# Altium schematic sheet LEDMicro.SchDOc
size OrCAD E
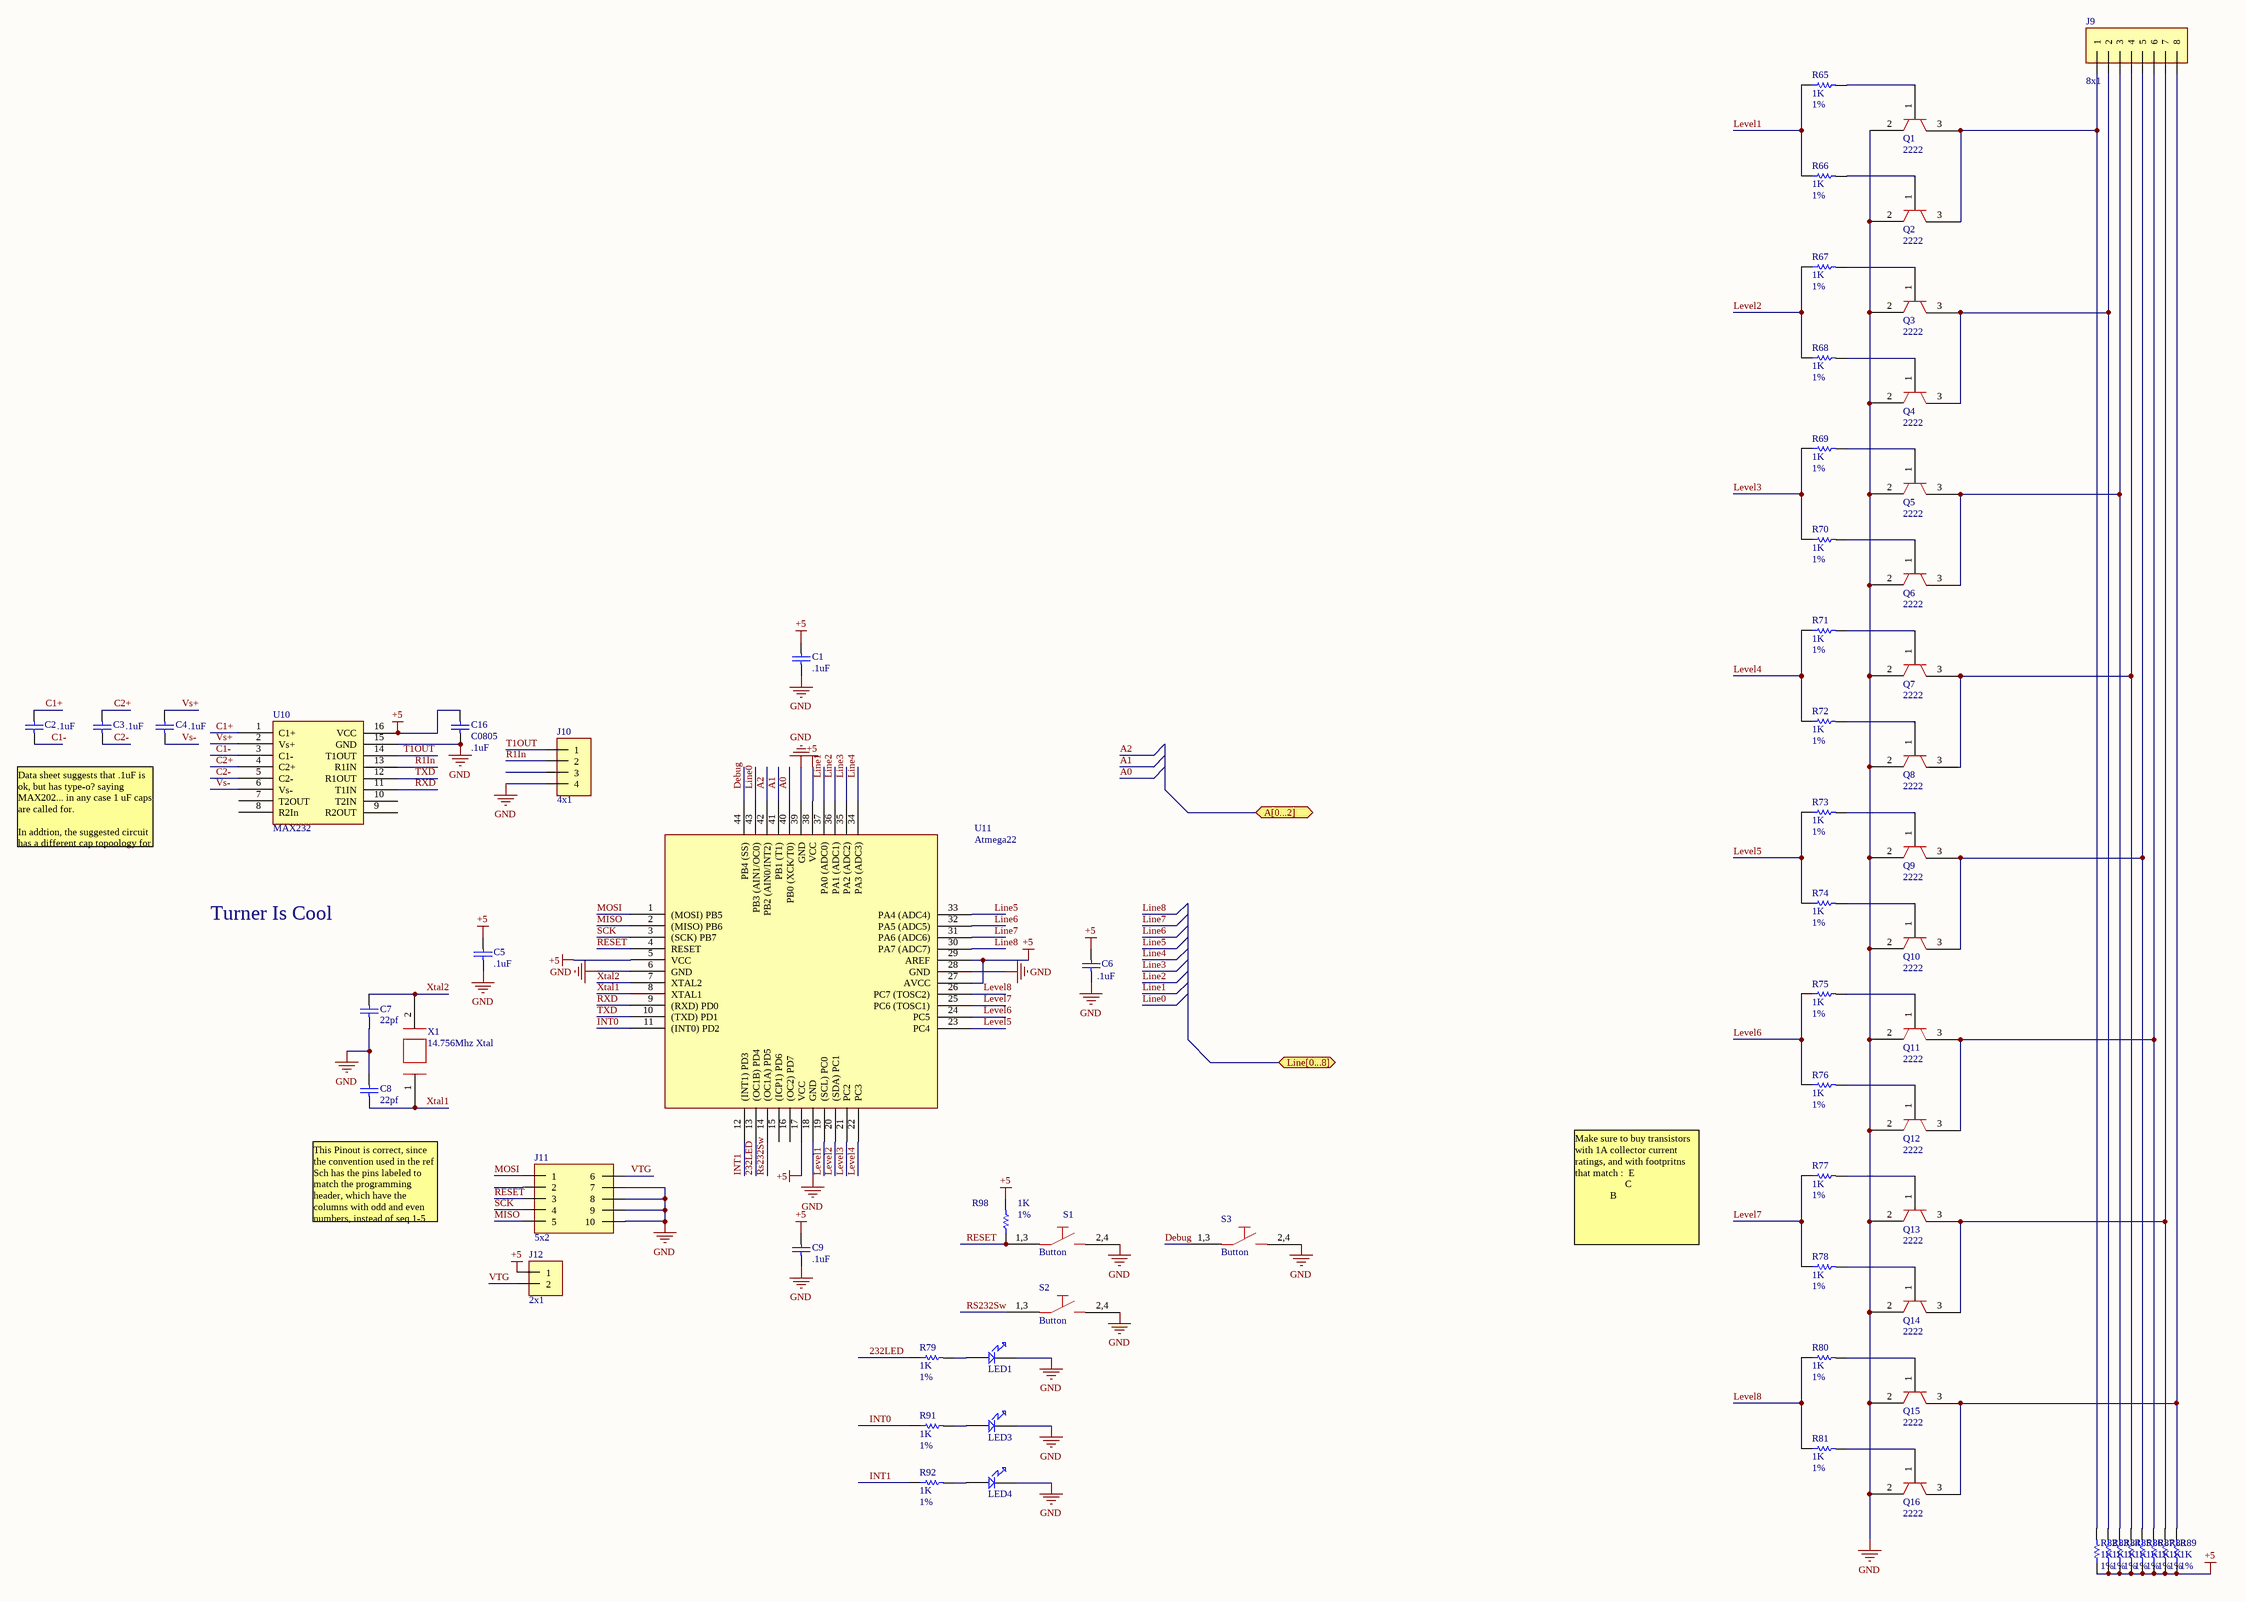
[diagram p0: LEDMicro.SchDOc]

## Parts
C1  .1uF  [0805 (2012) Capacitor]
C2  .1uF  [0805 (2012) Capacitor]
C3  .1uF  [0805 (2012) Capacitor]
C4  .1uF  [0805 (2012) Capacitor]
C5  .1uF  [0805 (2012) Capacitor]
C6  .1uF  [0805 (2012) Capacitor]
C7  22pf  [0603]
C8  22pf  [0603]
C9  .1uF  [0805 (2012) Capacitor]
C16  C0805  value .1uF  [0805]
J9  8x1  [Male 8x1]
J10  4x1  [Male 4x1]
J11  5x2  [Male 5x2]
J12  2x1  [Male 2X1]
LED1  LED  [LED 0805]  (value not drawn)
LED3  LED  [LED 0805]  (value not drawn)
LED4  LED  [LED 0805]  (value not drawn)
Q1  2222  [SOT-23]
Q2  2222  [SOT-23]
Q3  2222  [SOT-23]
Q4  2222  [SOT-23]
Q5  2222  [SOT-23]
Q6  2222  [SOT-23]
Q7  2222  [SOT-23]
Q8  2222  [SOT-23]
Q9  2222  [SOT-23]
Q10  2222  [SOT-23]
Q11  2222  [SOT-23]
Q12  2222  [SOT-23]
Q13  2222  [SOT-23]
Q14  2222  [SOT-23]
Q15  2222  [SOT-23]
Q16  2222  [SOT-23]
R65  Tolerance: 1%  [R 0805 (2012) RESISTOR]  (hidden comment: 1K)
R66  Tolerance: 1%  [R 0805 (2012) RESISTOR]  (hidden comment: 1K)
R67  Tolerance: 1%  [R 0805 (2012) RESISTOR]  (hidden comment: 1K)
R68  Tolerance: 1%  [R 0805 (2012) RESISTOR]  (hidden comment: 1K)
R69  Tolerance: 1%  [R 0805 (2012) RESISTOR]  (hidden comment: 1K)
R70  Tolerance: 1%  [R 0805 (2012) RESISTOR]  (hidden comment: 1K)
R71  Tolerance: 1%  [R 0805 (2012) RESISTOR]  (hidden comment: 1K)
R72  Tolerance: 1%  [R 0805 (2012) RESISTOR]  (hidden comment: 1K)
R73  Tolerance: 1%  [R 0805 (2012) RESISTOR]  (hidden comment: 1K)
R74  Tolerance: 1%  [R 0805 (2012) RESISTOR]  (hidden comment: 1K)
R75  Tolerance: 1%  [R 0805 (2012) RESISTOR]  (hidden comment: 1K)
R76  Tolerance: 1%  [R 0805 (2012) RESISTOR]  (hidden comment: 1K)
R77  Tolerance: 1%  [R 0805 (2012) RESISTOR]  (hidden comment: 1K)
R78  Tolerance: 1%  [R 0805 (2012) RESISTOR]  (hidden comment: 1K)
R79  Tolerance: 1%  [R 0805 (2012) RESISTOR]  (hidden comment: 1K)
R80  Tolerance: 1%  [R 0805 (2012) RESISTOR]  (hidden comment: 1K)
R81  Tolerance: 1%  [R 0805 (2012) RESISTOR]  (hidden comment: 1K)
R82  Tolerance: 1%  [R 0805 (2012) RESISTOR]  (hidden comment: 1K)
R83  Tolerance: 1%  [R 0805 (2012) RESISTOR]  (hidden comment: 1K)
R84  Tolerance: 1%  [R 0805 (2012) RESISTOR]  (hidden comment: 1K)
R85  Tolerance: 1%  [R 0805 (2012) RESISTOR]  (hidden comment: 1K)
R86  Tolerance: 1%  [R 0805 (2012) RESISTOR]  (hidden comment: 1K)
R87  Tolerance: 1%  [R 0805 (2012) RESISTOR]  (hidden comment: 1K)
R88  Tolerance: 1%  [R 0805 (2012) RESISTOR]  (hidden comment: 1K)
R89  Tolerance: 1%  [R 0805 (2012) RESISTOR]  (hidden comment: 1K)
R91  Tolerance: 1%  [R 0805 (2012) RESISTOR]  (hidden comment: 1K)
R92  Tolerance: 1%  [R 0805 (2012) RESISTOR]  (hidden comment: 1K)
R98  Tolerance: 1%  [R 0805 (2012) RESISTOR]  (hidden comment: 1K)
S1  Button  [B3F-1000]
S2  Button  [B3F-1000]
S3  Button  [B3F-1000]
U10  MAX232  [SOP16]
U11  Atmega22  [Quad44]
X1  14.756Mhz Xtal  [PCBComponent_1]

## Ports
A[0...2], Line[0...8]

## Nets
+5: C1.2 C5.2 C6.2 C9.2 C16.2 J12.1 R82.1 R83.1 R84.1 R85.1 R86.1 R87.1 R88.1 R89.1 R98.2 U10.16(VCC) U11.5(VCC) U11.17(VCC) U11.27(AVCC) U11.29(AREF) U11.38(VCC)
GND: C1.1 C5.1 C6.1 C7.1 C8.2 C9.1 C16.1 J10.4 J11.7 J11.8 J11.9 J11.10 LED1.1 LED3.1 LED4.1 Q1.2(E) Q2.2(E) Q3.2(E) Q4.2(E) Q5.2(E) Q6.2(E) Q7.2(E) Q8.2(E) Q9.2(E) Q10.2(E) Q11.2(E) Q12.2(E) Q13.2(E) Q14.2(E) Q15.2(E) Q16.2(E) S1.2,4 S2.2,4 S3.2,4 U10.15(GND) U11.6(GND) U11.18(GND) U11.28(GND) U11.39(GND)
232LED: R79.1 U11.13((OC1B)_PD4)
A0: U11.40(PB0_(XCK/T0))
A1: U11.41(PB1_(T1))
A2: U11.42(PB2_(AIN0/INT2))
C1+: C2.2 U10.1(C1+)
C1-: C2.1 U10.3(C1-)
C2+: C3.2 U10.4(C2+)
C2-: C3.1 U10.5(C2-)
Debug: S3.1,3 U11.44(PB4_(SS))
INT0: R91.1 U11.11((INT0)_PD2)
INT1: R92.1 U11.12((INT1)_PD3)
Level1: R65.1 R66.1 U11.19((SCL)_PC0)
Level2: R67.1 R68.1 U11.20((SDA)_PC1)
Level3: R69.1 R70.1 U11.21(PC2)
Level4: R71.1 R72.1 U11.22(PC3)
Level5: R73.1 R74.1 U11.23(PC4)
Level6: R75.1 R76.1 U11.24(PC5)
Level7: R77.1 R78.1 U11.25(PC6_(TOSC1))
Level8: R80.1 R81.1 U11.26(PC7_(TOSC2))
Line0: U11.43(PB3_(AIN1/OC0))
Line1: U11.37(PA0_(ADC0))
Line2: U11.36(PA1_(ADC1))
Line3: U11.35(PA2_(ADC2))
Line4: U11.34(PA3_(ADC3))
Line5: U11.33(PA4_(ADC4))
Line6: U11.32(PA5_(ADC5))
Line7: U11.31(PA6_(ADC6))
Line8: U11.30(PA7_(ADC7))
MISO: J11.5 U11.2((MISO)_PB6)
MOSI: J11.1 U11.1((MOSI)_PB5)
R1In: J10.2 U10.13(R1IN)
RESET: J11.3 R98.1 S1.1,3 U11.4(RESET)
Rs232Sw: S2.1,3 U11.14((OC1A)_PD5)
RXD: U10.11(T1IN) U11.9((RXD)_PD0)
SCK: J11.4 U11.3((SCK)_PB7)
T1OUT: J10.1 U10.14(T1OUT)
TXD: U10.12(R1OUT) U11.10((TXD)_PD1)
Vs+: C4.2 U10.2(Vs+)
Vs-: C4.1 U10.6(Vs-)
VTG: J11.6 J12.2
Xtal1: C8.1 U11.8(XTAL1) X1.1
Xtal2: C7.2 U11.7(XTAL2) X1.2
NetJ9_1: J9.1 Q1.3(C) Q2.3(C) R82.2
NetJ9_2: J9.2 Q3.3(C) Q4.3(C) R83.2
NetJ9_3: J9.3 Q5.3(C) Q6.3(C) R84.2
NetJ9_4: J9.4 Q7.3(C) Q8.3(C) R85.2
NetJ9_5: J9.5 Q9.3(C) Q10.3(C) R86.2
NetJ9_6: J9.6 Q11.3(C) Q12.3(C) R87.2
NetJ9_7: J9.7 Q13.3(C) Q14.3(C) R88.2
NetJ9_8: J9.8 Q15.3(C) Q16.3(C) R89.2
NetLED1_2: LED1.2 R79.2
NetLED3_2: LED3.2 R91.2
NetLED4_2: LED4.2 R92.2
NetQ1_1: Q1.1(B) R65.2
NetQ2_1: Q2.1(B) R66.2
NetQ3_1: Q3.1(B) R67.2
NetQ4_1: Q4.1(B) R68.2
NetQ5_1: Q5.1(B) R69.2
NetQ6_1: Q6.1(B) R70.2
NetQ7_1: Q7.1(B) R71.2
NetQ8_1: Q8.1(B) R72.2
NetQ9_1: Q9.1(B) R73.2
NetQ10_1: Q10.1(B) R74.2
NetQ11_1: Q11.1(B) R75.2
NetQ12_1: Q12.1(B) R76.2
NetQ13_1: Q13.1(B) R77.2
NetQ14_1: Q14.1(B) R78.2
NetQ15_1: Q15.1(B) R80.2
NetQ16_1: Q16.1(B) R81.2

Not connected (* = marked no-connect by the designer): J10 3; J11 2; U10 7(T2OUT) 8(R2In) 9(R2OUT) 10(T2IN); U11 15((ICP1)_PD6) 16((OC2)_PD7)

## Notes on the sheet
- Data sheet suggests that .1uF is ok, but has type-o? saying MAX202... in any case 1 uF caps are called for.
  In addtion, the suggested circuit has a different cap topoology for the VS+, VS- connections...
- Turner Is Cool
- This Pinout is correct, since the convention used in the ref Sch has the pins labeled to match the programming header, which have the columns with odd and even numbers, instead of seq 1-5 and 6-10. Keep in mind that to go from this sch to the ref sch, 2->3, 3->5, 4->7, 5->9, 6->2, 7->4, 8->6, 9->8, 10->10
- Make sure to buy transistors with 1A collector current ratings, and with footpritns that match :  E
  C
  B
- Title
- Size:
- Date:
- File:
- Orcad E
- Number:
- Time:
- Revision:
- Sheet
- of

## Library data of the parts
C1-C6 C9 = Capacitor (non-polarized): Capacitor; Value: .1uF
C7 C8 = Capacitor (non-polarized): Capacitor; Value: .1uF
C16 = C0805: Ceramic Chip Capacitor - Standard; Note: Footprint corresponds to dimensions for bulk cassette packaging. This case size has tightened tolerances.; Published: 17-Jul-2002; LatestRevisionDate: 19-Mar-2004; LatestRevisionNote: Silkscreen size reduced.; DatasheetDocument: Mar-2001; PackageDocument: Mar-2001; PackageReference: 0805; Publisher: Altium Limited; Code_JEITA: 0805; Code_IPC: 2012[0805]; ComponentLink1Description: Manufacturer Link; ComponentLink1URL: http://www.kemet.com/; ComponentLink2Description: Datasheet; ComponentLink2URL: http://www.kemet.com/kemet/web/homepage/kechome.nsf/vapubfilesname/F3102TA.pdf/$file/F3102TA.pdf
J9 = 8x1: 8x1 100mil Header
J10 = 4x1: 4x1 100mil Header
J11 = 5x2: 5x2 100mil Header
J12 = 2x1: 2x1 100mil Header
LED1 LED3 LED4 = LED: Standard LED
Q1-Q16 = MMST2222A: Trans NPN Bipolar 40V
R65-R89 R91 R92 R98 = RES 0805 1K 1%: Value: 1K
U10 = MAX232: IC DUAL EIA-232 DRVR/RCVR 16SOIC
U11 = ATMEGA 32: IC MCU 8BIT 8KB FLASH 44TQFP
X1 = Crystal